# EAGLE design Protoboard MX4-7-6-ESP12 (EAGLE 7.7.0)
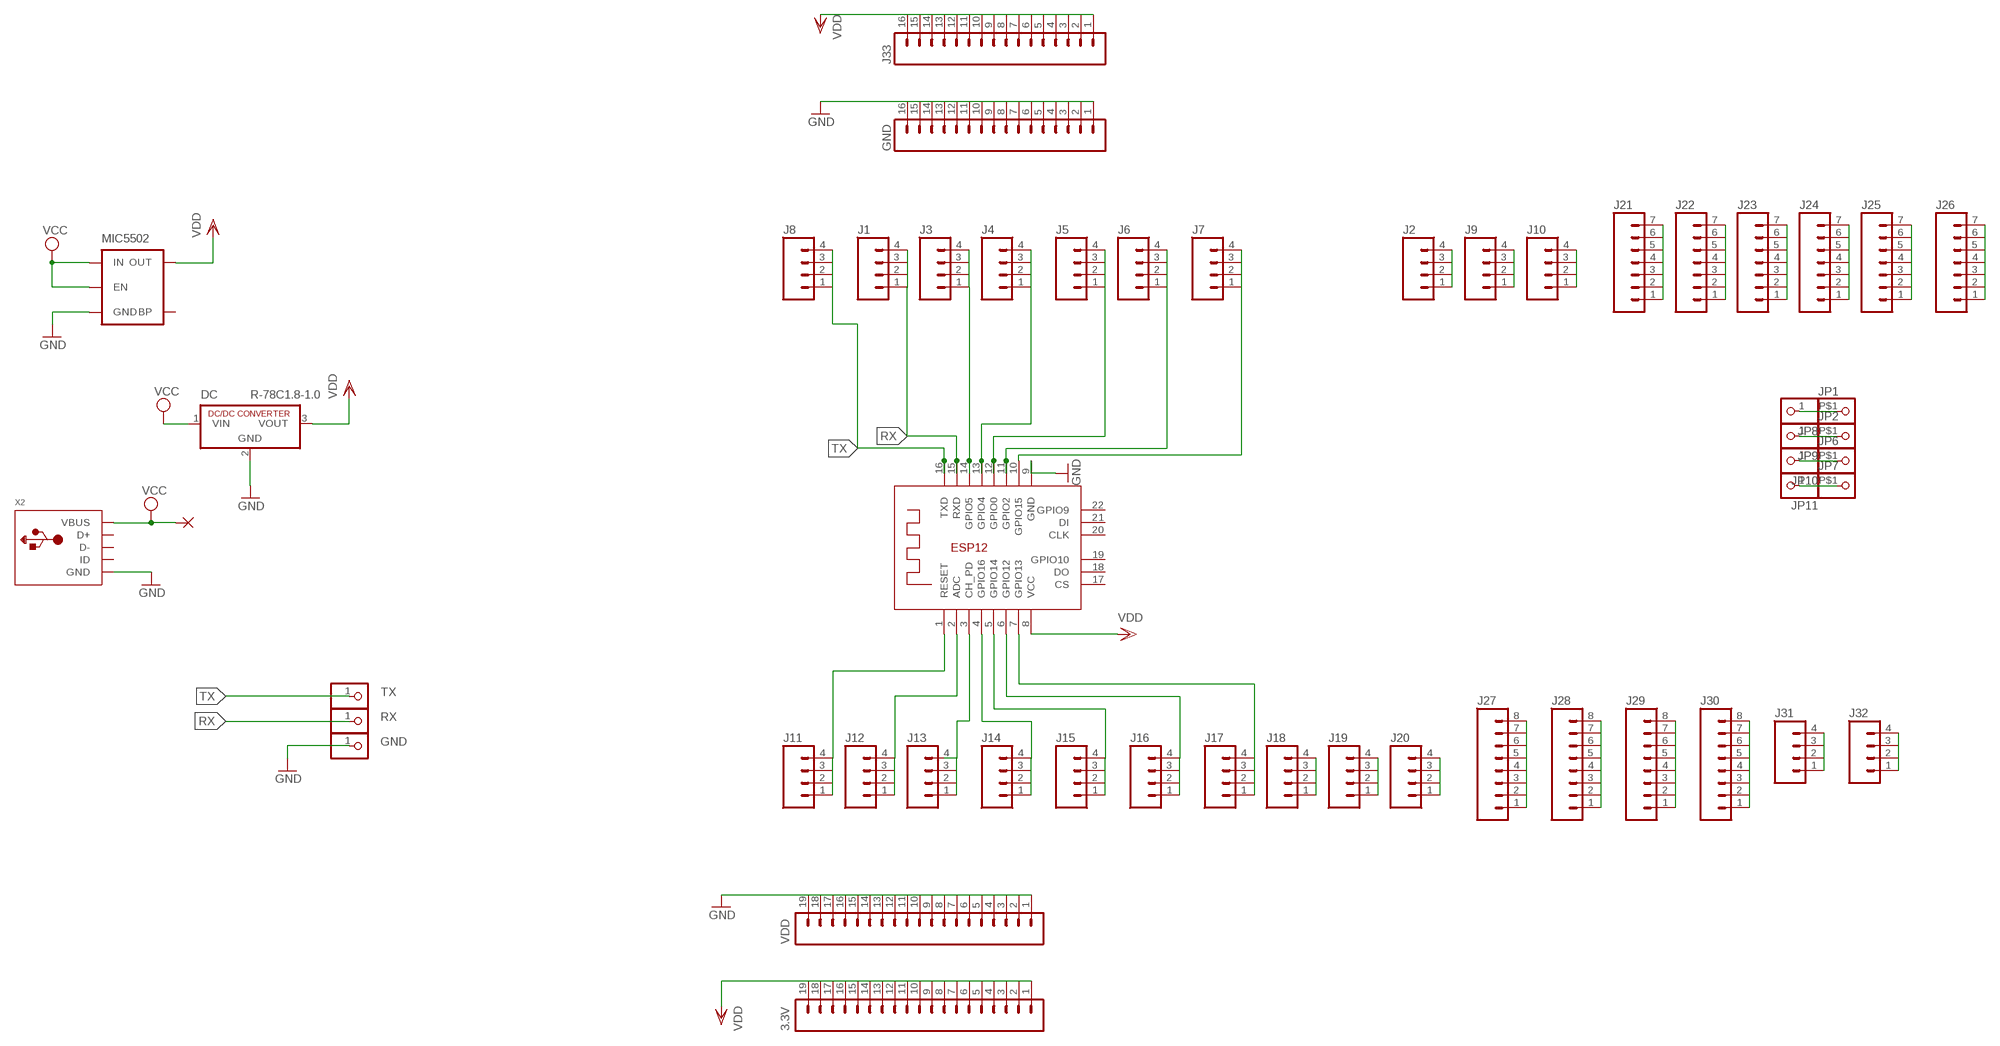
[diagram p0: schematic, sheet 1]

## Parts
3.3V  M191X19_NO_SILK  [1X19_NO_SILK]
5V  1,6/0,8  [1,6/0,8]
DC  R-78C1.8-1.0  [SIP3]
GND  M161X16_NO_SILK  [1X16_NO_SILK]
J1  M04NO_SILK_ALL_ROUND  [1X04_NO_SILK_ALL_ROUND]
J2  M04NO_SILK_ALL_ROUND  [1X04_NO_SILK_ALL_ROUND]
J3  M04NO_SILK_ALL_ROUND  [1X04_NO_SILK_ALL_ROUND]
J4  M04NO_SILK_ALL_ROUND  [1X04_NO_SILK_ALL_ROUND]
J5  M04NO_SILK_ALL_ROUND  [1X04_NO_SILK_ALL_ROUND]
J6  M04NO_SILK_ALL_ROUND  [1X04_NO_SILK_ALL_ROUND]
J7  M04NO_SILK_ALL_ROUND  [1X04_NO_SILK_ALL_ROUND]
J8  M04NO_SILK_ALL_ROUND  [1X04_NO_SILK_ALL_ROUND]
J9  M04NO_SILK_ALL_ROUND  [1X04_NO_SILK_ALL_ROUND]
J10  M04NO_SILK_ALL_ROUND  [1X04_NO_SILK_ALL_ROUND]
J11  M04NO_SILK_ALL_ROUND  [1X04_NO_SILK_ALL_ROUND]
J12  M04NO_SILK_ALL_ROUND  [1X04_NO_SILK_ALL_ROUND]
J13  M04NO_SILK_ALL_ROUND  [1X04_NO_SILK_ALL_ROUND]
J14  M04NO_SILK_ALL_ROUND  [1X04_NO_SILK_ALL_ROUND]
J15  M04NO_SILK_ALL_ROUND  [1X04_NO_SILK_ALL_ROUND]
J16  M04NO_SILK_ALL_ROUND  [1X04_NO_SILK_ALL_ROUND]
J17  M04NO_SILK_ALL_ROUND  [1X04_NO_SILK_ALL_ROUND]
J18  M04NO_SILK_ALL_ROUND  [1X04_NO_SILK_ALL_ROUND]
J19  M04NO_SILK_ALL_ROUND  [1X04_NO_SILK_ALL_ROUND]
J20  M04NO_SILK_ALL_ROUND  [1X04_NO_SILK_ALL_ROUND]
J21  M07NO_SILK  [1X07_NO_SILK]
J22  M07NO_SILK  [1X07_NO_SILK]
J23  M07NO_SILK  [1X07_NO_SILK]
J24  M07NO_SILK  [1X07_NO_SILK]
J25  M07NO_SILK  [1X07_NO_SILK]
J26  M07NO_SILK  [1X07_NO_SILK]
J27  M08NO_SILK_FEMALE_PTH  [1X08_NO_SILK]
J28  M08NO_SILK_FEMALE_PTH  [1X08_NO_SILK]
J29  M08NO_SILK_FEMALE_PTH  [1X08_NO_SILK]
J30  M08NO_SILK_FEMALE_PTH  [1X08_NO_SILK]
J31  M04NO_SILK_ALL_ROUND  [1X04_NO_SILK_ALL_ROUND]
J32  M04NO_SILK_ALL_ROUND  [1X04_NO_SILK_ALL_ROUND]
J33  M161X16_NO_SILK  [1X16_NO_SILK]
JP1  PINHD-1X1-BIGPOGO  [1X1-BIGPOGO]
JP2  PINHD-1X1-BIGPOGO  [1X1-BIGPOGO]
JP3  TX  PINHD-1X1CB  [1X01-CLEANBIG]
JP4  RX  PINHD-1X1CB  [1X01-CLEANBIG]
JP5  GND  PINHD-1X1CB  [1X01-CLEANBIG]
JP6  PINHD-1X1-BIGPOGO  [1X1-BIGPOGO]
JP7  PINHD-1X1-BIGPOGO  [1X1-BIGPOGO]
JP8  PINHD-1X1CB  [1X01-CLEANBIG]
JP9  PINHD-1X1CB  [1X01-CLEANBIG]
JP10  PINHD-1X1CB  [1X01-CLEANBIG]
JP11  PINHD-1X1CB  [1X01-CLEANBIG]
MIC5502  MIC52053.3V  [SOT23-5]
VDD  M191X19_NO_SILK  [1X19_NO_SILK]
X1  ESP-12E  [ESP-12E]
X2  USBMICRO_20329  [4UCONN_20329]

## Nets
GND: DC.2(GND) GND.1 GND.2 GND.3 GND.4 GND.5 GND.6 GND.7 GND.8 GND.9 GND.10 GND.11 GND.12 GND.13 GND.14 GND.15 GND.16 JP5.1 MIC5502.2(GND) VDD.1 VDD.2 VDD.3 VDD.4 VDD.5 VDD.6 VDD.7 VDD.8 VDD.9 VDD.10 VDD.11 VDD.12 VDD.13 VDD.14 VDD.15 VDD.16 VDD.17 VDD.18 VDD.19 X1.9(GND) X2.BASE@1(GND) X2.BASE@2(GND) X2.GND X2.SPRT@1(GND) X2.SPRT@2(GND) X2.SPRT@3(GND) X2.SPRT@4(GND)
N$1: J21.1 J21.2 J21.3 J21.4 J21.5 J21.6 J21.7
N$8: J2.1 J2.2 J2.3 J2.4
N$9: J3.1 J3.2 J3.3 J3.4 X1.14(GPIO5)
N$10: J4.1 J4.2 J4.3 J4.4 X1.13(GPIO4)
N$11: J5.1 J5.2 J5.3 J5.4 X1.12(GPIO0)
N$12: J6.1 J6.2 J6.3 J6.4 X1.11(GPIO2)
N$13: J7.1 J7.2 J7.3 J7.4 X1.10(GPIO15)
N$14: J9.1 J9.2 J9.3 J9.4
N$15: J10.1 J10.2 J10.3 J10.4
N$16: J18.1 J18.2 J18.3 J18.4
N$17: J22.1 J22.2 J22.3 J22.4 J22.5 J22.6 J22.7
N$18: J23.1 J23.2 J23.3 J23.4 J23.5 J23.6 J23.7
N$19: J24.1 J24.2 J24.3 J24.4 J24.5 J24.6 J24.7
N$20: J25.1 J25.2 J25.3 J25.4 J25.5 J25.6 J25.7
N$21: J26.1 J26.2 J26.3 J26.4 J26.5 J26.6 J26.7
N$22: J27.1 J27.2 J27.3 J27.4 J27.5 J27.6 J27.7 J27.8
N$23: J19.1 J19.2 J19.3 J19.4
N$24: J20.1 J20.2 J20.3 J20.4
N$25: J28.1 J28.2 J28.3 J28.4 J28.5 J28.6 J28.7 J28.8
N$26: J14.1 J14.2 J14.3 J14.4 X1.4(GPIO16)
N$27: J29.1 J29.2 J29.3 J29.4 J29.5 J29.6 J29.7 J29.8
N$28: J30.1 J30.2 J30.3 J30.4 J30.5 J30.6 J30.7 J30.8
N$29: J31.1 J31.2 J31.3 J31.4
N$30: J32.1 J32.2 J32.3 J32.4
N$31: JP1.P$1 JP8.1
N$32: JP2.P$1 JP9.1
N$33: JP6.P$1 JP10.1
N$34: J17.1 J17.2 J17.3 J17.4 X1.7(GPIO13)
N$35: JP7.P$1 JP11.1
N$50: J11.1 J11.2 J11.3 J11.4 X1.1(RESET)
N$51: J12.1 J12.2 J12.3 J12.4 X1.2(ADC)
N$52: J13.1 J13.2 J13.3 J13.4 X1.3(CH_PD)
N$55: J15.1 J15.2 J15.3 J15.4 X1.5(GPIO14)
N$56: J16.1 J16.2 J16.3 J16.4 X1.6(GPIO12)
RX: J1.1 J1.2 J1.3 J1.4 JP4.1 X1.15(RXD)
TX: J8.1 J8.2 J8.3 J8.4 JP3.1 X1.16(TXD)
VCC: 5V.1(P) DC.1(VIN) MIC5502.1(IN) MIC5502.3(EN) X2.VBUS
VDD: 3.3V.1 3.3V.2 3.3V.3 3.3V.4 3.3V.5 3.3V.6 3.3V.7 3.3V.8 3.3V.9 3.3V.10 3.3V.11 3.3V.12 3.3V.13 3.3V.14 3.3V.15 3.3V.16 3.3V.17 3.3V.18 3.3V.19 DC.3(VOUT) J33.1 J33.2 J33.3 J33.4 J33.5 J33.6 J33.7 J33.8 J33.9 J33.10 J33.11 J33.12 J33.13 J33.14 J33.15 J33.16 MIC5502.5(OUT) X1.8(VCC)
Unconnected: MIC5502.4(BP) X1.17(CS) X1.18(DO) X1.19(GPIO10) X1.20(CLK) X1.21(DI) X1.22(GPIO9) X2.D+ X2.D- X2.ID

## Library data of the parts
3.3V VDD = SparkFun-Connectors:M19: 1x19 .1" header
5V = wirepad:1,6/0,8: THROUGH-HOLE PAD
DC = dc-dc-converter:R-78C*-1.0: INNOLINE DC/DC-Converter 1.0 AMP SIP3 Single Output Source: Data sheet <http://www.mikrocontroller.net/attachment/150645/157764-da-01-en-DC_DC_WANDLER_R_78C5_0_1_0.pdf>
GND J33 = SparkFun-Connectors:M16: 1x16 .1" header
J1-J20 J31 J32 = SparkFun-Connectors:M04: Header 4 Standard 4-pin 0.1" header. Use with straight break away headers (SKU : PRT-00116), right angle break away headers (PRT-00553), swiss pins (PRT-00743), machine pins (PRT-00117), and female headers (PRT-00115). Molex polarized connector foot print use with SKU : PRT-08231 with associated crimp pins and housings. 1MM SMD Version SKU: PRT-10208; PROD_ID: CONN-09696
J21-J26 = SparkFun-Connectors:M07: Header 7 Standard 7-pin 0.1" header. Use with straight break away headers (SKU : PRT-00116), right angle break away headers (PRT-00553), swiss pins (PRT-00743), machine pins (PRT-00117), and female headers (PRT-00115). NOTES ON THE VARIANTS LOCK and LOCK_LONGPADS... This footprint was designed to help hold the alignment of a through-hole component (i.e. 7-pin header) while soldering it into place. You may notice that each hole has been shifted either up or down by 0.005 of an inch from it's more standard position (which is usually a perfectly straight line). This slight alteration caused the pins (the squares in the middle) to touch the edges of the holes. Because they are alternating, it causes a "brace" to hold the header in place. 0.005 has proven to be the perfect amount of "off-center" position when using our standard breakaway headers. Although looks a little odd when you look at the bare footprint, once you have a header in there, the alteration is very hard to notice. Also, if you push a header all the way into place, it is covered up entirely on the bottom side. This idea of altering the position of holes to aid alignment will be further integrated into the Sparkfun Library for other footprints. It can help hold any component with 3 or more connection pins.
J27-J30 = SparkFun-Connectors:M08: Header 8 Standard 8-pin 0.1" header. Use with straight break away headers (SKU : PRT-00116), right angle break away headers (PRT-00553), swiss pins (PRT-00743), machine pins (PRT-00117), and female headers (PRT-00115).; PROD_ID: CONN-08438
JP1-JP11 = adafruit:PINHD-1X1: Pin header 1x1 for 0.1" spacing With round pins
MIC5502 = SparkFun-PowerIC:MIC5205: MIC5205 150mA vreg 3.3V - VREG-00822 5V - VREG-00823; PROD_ID: VREG-00822
X1 = microbuilder:ESP-12E
X2 = microbuilder:USB: USB Connectors USBMINIB - Surface Mount Female Mini-B USB Connector 4UConnector: 06564

## Net classes
0 default: width 0.508 mm, drill 0.508 mm, clearance 0.127 mm

## Board
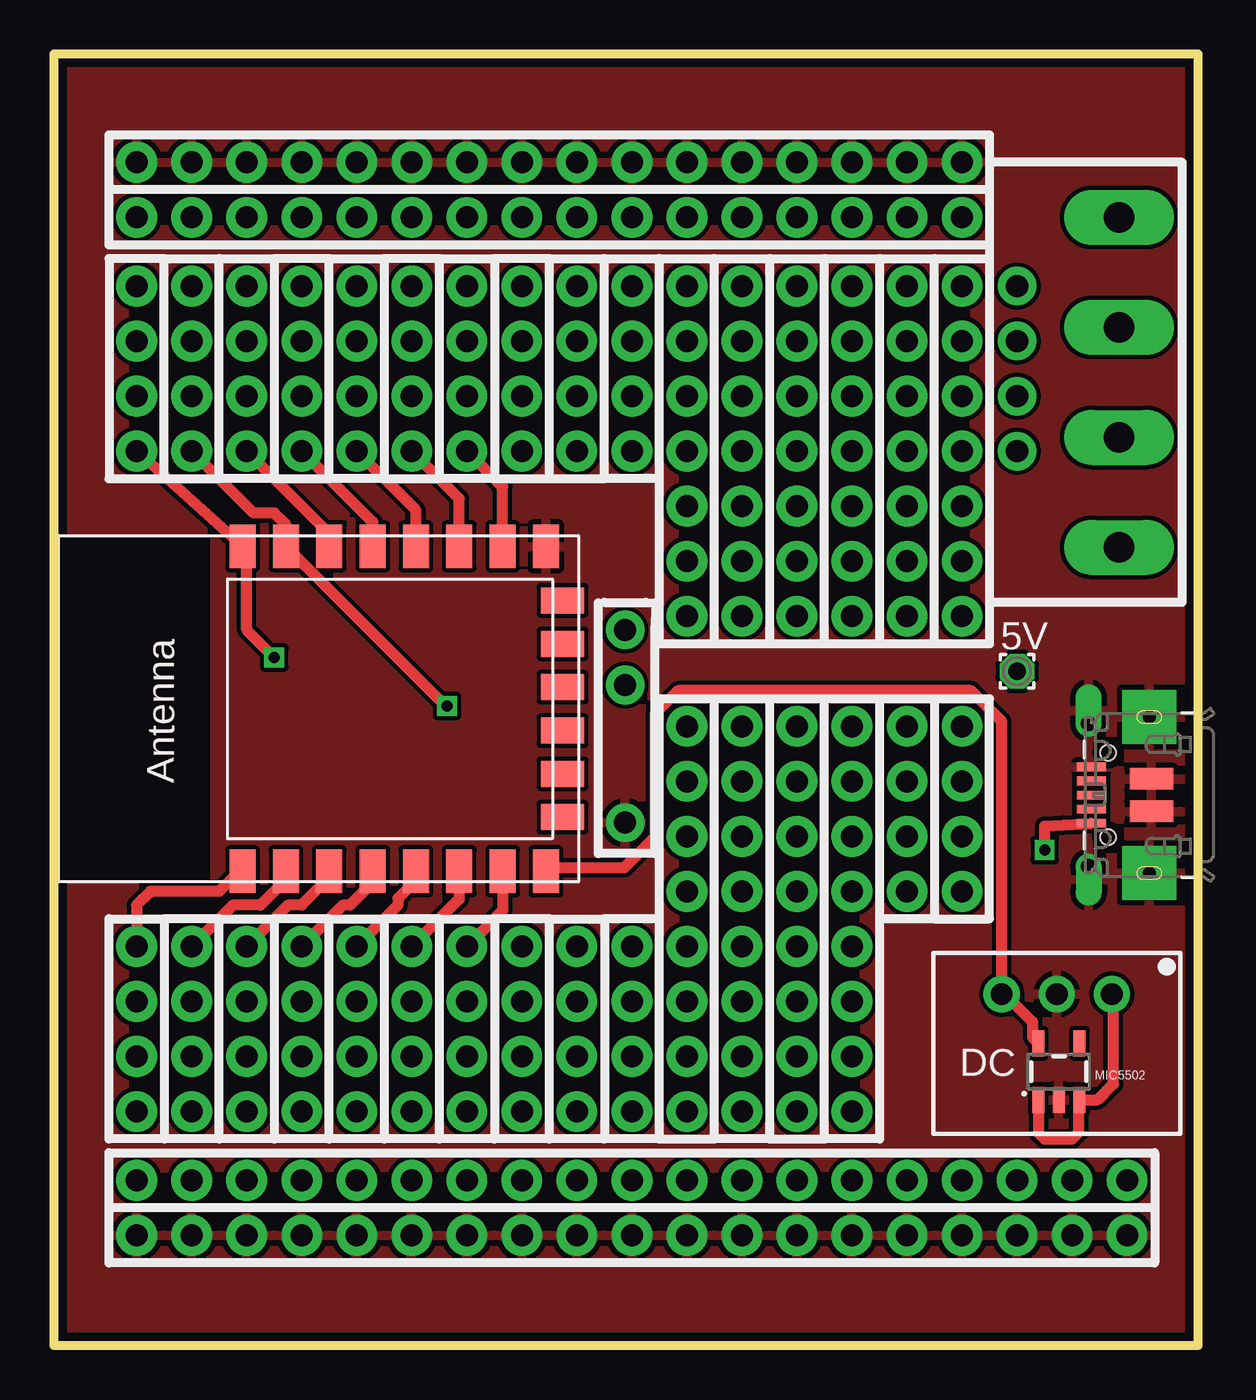
[diagram p1: board, top side]
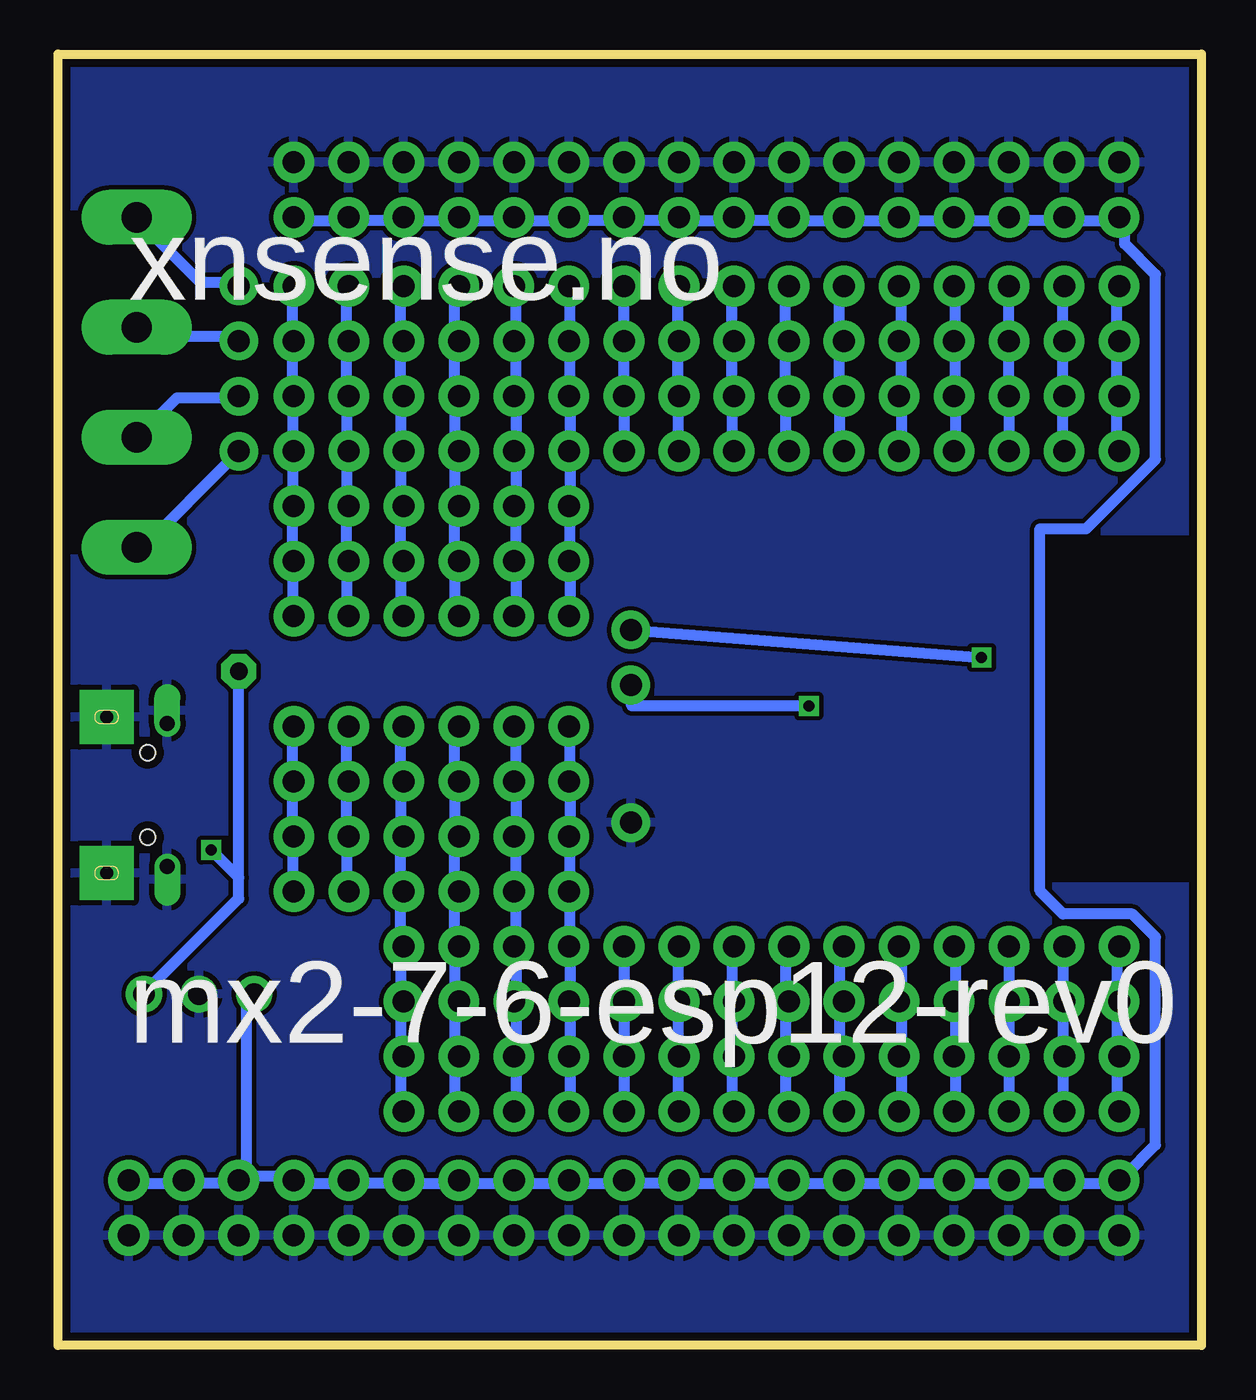
[diagram p2: board, bottom side, seen from below]

Size 52.8 x 59.6 mm. Coordinates in mm from the lower left corner, seen from the top.
Outline: 0,0 0,59.6 52.8,59.6 52.8,0 0,0
Copper layers (1*16): Top 0.035mm / dielectric 1.5mm / Bottom 0.035mm
Design rules "default *": minimum track width 10mil, minimum drill 20mil, track to track 8mil, track to pad 8mil, pad to pad 8mil, via to via 8mil, smd to smd 8mil, copper to edge 15mil, drill to drill 8mil, minimum pad ring 10mil, minimum via ring 8mil, stop-mask expansion 4mil, vias tented up to drill 0mil, thermal gap 10mil

### Footprints (pad centres in the part's own frame; a part is rotated, then mirrored left to right if it is on the bottom)
1X19_NO_SILK = drill 1.016 pad 1.88: 1 0,0; 2 2.54,0; 3 5.08,0; 4 7.62,0; 5 10.16,0; 6 12.7,0; 7 15.24,0; 8 17.78,0; 9 20.32,0; 10 22.86,0; 11 25.4,0; 12 27.94,0; 13 30.48,0; 14 33.02,0; 15 35.56,0; 16 38.1,0; 17 40.64,0; 18 43.18,0; 19 45.72,0
1,6/0,8 = drill 0.813 pad 1.6 octagon: 1 0,0
SIP3 = drill 1 pad 1.676: 1 -2.54,0; 2 0,0; 3 2.54,0
1X16_NO_SILK = drill 1.016 pad 1.88: 1 0,0; 2 2.54,0; 3 5.08,0; 4 7.62,0; 5 10.16,0; 6 12.7,0; 7 15.24,0; 8 17.78,0; 9 20.32,0; 10 22.86,0; 11 25.4,0; 12 27.94,0; 13 30.48,0; 14 33.02,0; 15 35.56,0; 16 38.1,0
1X04_NO_SILK_ALL_ROUND = drill 1.016 pad 1.88: 1 0,0; 2 2.54,0; 3 5.08,0; 4 7.62,0
1X07_NO_SILK = drill 1.016 pad 1.88: 1 0,0; 2 2.54,0; 3 5.08,0; 4 7.62,0; 5 10.16,0; 6 12.7,0; 7 15.24,0
1X08_NO_SILK = drill 1.016 pad 1.88: 1 0,0; 2 2.54,0; 3 5.08,0; 4 7.62,0; 5 10.16,0; 6 12.7,0; 7 15.24,0; 8 17.78,0
1X1-BIGPOGO = drill 1.4 pad 2.54 long: P$1 0,0
1X01-CLEANBIG = drill 1.016 pad 1.778: 1 0,0
SOT23-5 = smd 0.55 x 1.2: 1 -0.95,-1.3; 2 0,-1.3; 3 0.95,-1.3; 4 0.95,1.3; 5 -0.95,1.3
ESP-12E = smd 2 x 1.2: 1 -7.5,5.77; 2 -7.5,3.77; 3 -7.5,1.77; 4 -7.5,-0.23; 5 -7.5,-2.23; 6 -7.5,-4.23; 7 -7.5,-6.23; 8 -7.5,-8.23; 9 7.5,-8.23; 10 7.5,-6.23; 11 7.5,-4.23; 12 7.5,-2.23; 13 7.5,-0.23; 14 7.5,1.77; 15 7.5,3.77; 16 7.5,5.77 | smd 1.2 x 2: 17 -5,-9; 18 -3,-9; 19 -1,-9; 20 1,-9; 21 3,-9; 22 5,-9
4UCONN_20329 = smd 1 x 2: BASE@1 -0.75,-2; BASE@2 0.75,-2 | smd 0.4 x 1.35: D+ 0,0.775; D- -0.65,0.775; GND 1.3,0.775; ID 0.65,0.775; VBUS -1.3,0.775 | drill 0.7 offset: SPRT@1 -3.3,0.9; SPRT@2 3.3,0.9 | drill 0.6 pad 2.5 square: SPRT@3 -3.6,-1.9; SPRT@4 3.6,-1.9 | hole 0.7: -1.95,0; 1.95,0

### Placement (x,y rotation side)
3.3V  3.81,7.62 0 top
5V  44.45,31.11 0 top
DC  46.28,16.21 180 top
GND  3.81,54.61 0 top
J1  6.35,41.27 90 top
J2  21.59,41.27 90 top
J3  8.89,41.27 90 top
J4  11.43,41.27 90 top
J5  13.97,41.27 90 top
J6  16.51,41.27 90 top
J7  19.05,41.27 90 top
J8  3.81,41.27 90 top
J9  24.13,41.27 90 top
J10  26.67,41.27 90 top
J11  3.81,10.79 90 top
J12  6.35,10.79 90 top
J13  8.89,10.79 90 top
J14  11.43,10.79 90 top
J15  13.97,10.79 90 top
J16  16.51,10.79 90 top
J17  19.05,10.79 90 top
J18  21.59,10.79 90 top
J19  24.13,10.79 90 top
J20  26.67,10.79 90 top
J21  29.21,33.66 90 top
J22  31.75,33.66 90 top
J23  34.29,33.66 90 top
J24  36.83,33.66 90 top
J25  39.37,33.66 90 top
J26  41.91,33.66 90 top
J27  29.21,10.79 90 top
J28  31.75,10.79 90 top
J29  34.29,10.79 90 top
J30  36.83,10.79 90 top
J31  39.37,20.95 90 top
J32  41.91,20.95 90 top
J33  3.81,52.07 0 top
JP1  49.16,52.07 0 top
JP2  49.16,46.99 0 top
JP3  26.35,33.02 0 top
JP4  26.35,30.48 0 top
JP5  26.35,24.13 0 top
JP6  49.16,41.91 0 top
JP7  49.16,36.83 0 top
JP8  44.45,48.9 0 top
JP9  44.45,46.35 0 top
JP10  44.45,43.81 0 top
JP11  44.45,41.27 0 top
MIC5502  46.38,12.64 0 top
VDD  3.81,5.08 0 top
X1  14.47,29.38 90 top
X2  48.65,25.4 90 top

### Tracks (layer width: path | path; a pad name or v marks a point on that pad's centre or on a via)
GND
  pour Top: 0,59.6 0,0 52.8,0 52.8,59.6
  pour Bottom: 0,59.6 0,0 52.8,0 52.8,59.6
N$1
  Bottom 0.508: J21.1 29.16,33.78 29.16,35.92 J21.2 29.16,36.27 29.16,38.41 J21.3 29.16,38.76 29.16,41.25 J21.4 29.16,41.6 29.16,43.74 J21.5 29.16,44.09 29.16,46.23 J21.6 29.16,46.58 29.16,48.72 J21.7
N$8
  Bottom 0.508: J2.1 21.69,41.6 21.69,43.74 J2.2 21.69,44.09 21.69,46.23 J2.3 21.69,46.58 21.69,48.72 J2.4
N$9
  Top 0.508: X1.14 12.7,37.47 J3.1
  Bottom 0.508: J3.1 J3.2 J3.3 J3.4
N$10
  Top 0.508: X1.13 14.7,38.01 J4.1
  Bottom 0.508: J4.1 11.38,41.6 11.38,43.74 J4.2 11.38,44.09 11.38,46.23 J4.3 11.38,46.58 11.38,48.72 J4.4
N$11
  Top 0.508: X1.12 16.7,38.55 J5.1
  Bottom 0.508: J5.1 13.87,41.6 13.87,43.74 J5.2 13.87,44.09 13.87,46.23 J5.3 13.87,46.58 13.87,48.72 J5.4
N$12
  Top 0.508: X1.11 18.7,39.09 J6.1
  Bottom 0.508: J6.1 16.71,41.6 16.71,43.74 J6.2 16.71,44.09 16.71,46.23 J6.3 16.71,46.58 16.71,48.72 J6.4
N$13
  Top 0.508: X1.10 20.7,39.62 J7.1
  Bottom 0.508: J7.1 19.2,41.6 19.2,43.74 J7.2 19.2,44.09 19.2,46.23 J7.3 19.2,46.58 19.2,48.72 J7.4
N$14
  Bottom 0.508: J9.1 24.18,41.6 24.18,43.74 J9.2 24.18,44.09 24.18,46.23 J9.3 24.18,46.58 24.18,48.72 J9.4
N$15
  Bottom 0.508: J10.1 J10.2 J10.3 J10.4
N$16
  Bottom 0.508: J18.1 21.69,11.02 21.69,13.16 J18.2 21.69,13.51 21.69,15.65 J18.3 21.69,16 21.69,18.14 J18.4
N$17
  Bottom 0.508: J22.1 31.65,33.78 31.65,35.92 J22.2 31.65,36.27 31.65,38.41 J22.3 31.65,38.76 31.65,41.25 J22.4 31.65,41.6 31.65,43.74 J22.5 31.65,44.09 31.65,46.23 J22.6 31.65,46.58 31.65,48.72 J22.7
N$18
  Bottom 0.508: J23.1 34.49,33.78 34.49,35.92 J23.2 34.49,36.27 34.49,38.41 J23.3 34.49,38.76 34.49,41.25 J23.4 34.49,41.6 34.49,43.74 J23.5 34.49,44.09 34.49,46.23 J23.6 34.49,46.58 34.49,48.72 J23.7
N$19
  Bottom 0.508: J24.1 36.98,33.78 36.98,35.92 J24.2 36.98,36.27 36.98,38.41 J24.3 36.98,38.76 36.98,41.25 J24.4 36.98,41.6 36.98,43.74 J24.5 36.98,44.09 36.98,46.23 J24.6 36.98,46.58 36.98,48.72 J24.7
N$20
  Bottom 0.508: J25.1 39.47,33.78 39.47,35.92 J25.2 39.47,36.27 39.47,38.41 J25.3 39.47,38.76 39.47,41.25 J25.4 39.47,41.6 39.47,43.74 J25.5 39.47,44.09 39.47,46.23 J25.6 39.47,46.58 39.47,48.72 J25.7
N$21
  Bottom 0.508: J26.1 41.96,33.78 41.96,35.92 J26.2 41.96,36.27 41.96,38.41 J26.3 41.96,38.76 41.96,41.25 J26.4 41.96,41.6 41.96,43.74 J26.5 41.96,44.09 41.96,46.23 J26.6 41.96,46.58 41.96,48.72 J26.7
N$22
  Bottom 0.508: J27.8 29.16,28.45 29.16,26.31 J27.7 29.16,25.96 29.16,23.82 J27.6 29.16,23.47 29.16,20.98 J27.5 29.16,20.62 29.16,18.49 J27.4 29.16,18.14 29.16,16 J27.3 29.16,15.65 29.16,13.51 J27.2 29.16,13.16 29.16,11.02 J27.1
N$23
  Bottom 0.508: J19.1 24.18,11.02 24.18,13.16 J19.2 24.18,13.51 24.18,15.65 J19.3 24.18,16 24.18,18.14 J19.4
N$24
  Bottom 0.508: J20.1 J20.2 J20.3 J20.4
N$25
  Bottom 0.508: J28.8 31.65,28.45 31.65,26.31 J28.7 31.65,25.96 31.65,23.82 J28.6 31.65,23.47 31.65,20.98 J28.5 31.65,20.62 31.65,18.49 J28.4 31.65,18.14 31.65,16 J28.3 31.65,15.65 31.65,13.51 J28.2 31.65,13.16 31.65,11.02 J28.1
N$26
  Top 0.508: X1.4 14.7,21.37 13.65,20.32 13.34,20.32 J14.4
  Bottom 0.508: J14.1 11.38,11.02 11.38,13.16 J14.2 11.38,13.51 11.38,15.65 J14.3 11.38,16 11.38,18.14 J14.4
N$27
  Bottom 0.508: J29.8 34.49,28.45 34.49,26.31 J29.7 34.49,25.96 34.49,23.82 J29.6 34.49,23.47 34.49,20.98 J29.5 34.49,20.62 34.49,18.49 J29.4 34.49,18.14 34.49,16 J29.3 34.49,15.65 34.49,13.51 J29.2 34.49,13.16 34.49,11.02 J29.1
N$28
  Bottom 0.508: J30.8 36.98,28.45 36.98,26.31 J30.7 36.98,25.96 36.98,23.82 J30.6 36.98,23.47 36.98,20.98 J30.5 36.98,20.62 36.98,18.49 J30.4 36.98,18.14 36.98,16 J30.3 36.98,15.65 36.98,13.51 J30.2 36.98,13.16 36.98,11.02 J30.1
N$29
  Bottom 0.508: J31.1 39.47,20.98 39.47,23.47 J31.2 39.47,23.82 39.47,25.96 J31.3 39.47,26.31 39.47,28.45 J31.4
N$30
  Bottom 0.508: J32.1 41.96,20.98 41.96,23.47 J32.2 41.96,23.82 41.96,25.96 J32.3 41.96,26.31 41.96,28.45 J32.4
N$31
  Bottom 0.508: JP8.1 44.45,49.07 46.23,49.07 49.07,51.92 JP1.P$1
N$32
  Bottom 0.508: JP9.1 44.45,46.58 48.72,46.58 49.07,46.94 JP2.P$1
N$33
  Bottom 0.508: JP10.1 44.45,43.74 47.3,43.74 49.07,41.96 JP6.P$1
N$34
  Top 0.508: X1.7 20.7,20.07 J17.4
  Bottom 0.508: J17.1 19.2,11.02 19.2,13.16 J17.2 19.2,13.51 19.2,15.65 J17.3 19.2,16 19.2,18.14 J17.4
N$35
  Bottom 0.508: JP11.1 44.45,41.25 49.07,36.63 JP7.P$1
N$50
  Top 0.508: X1.1 8.54,21.88 7.62,20.95 4.45,20.95 3.81,20.32 J11.4
  Bottom 0.508: J11.1 3.91,11.02 3.91,13.16 J11.2 3.91,13.51 3.91,15.65 J11.3 3.91,16 3.91,18.14 J11.4
N$51
  Top 0.508: X1.2 10.7,21.5 9.53,20.32 8.26,20.32 J12.4
  Bottom 0.508: J12.1 6.4,11.02 6.4,13.16 J12.2 6.4,13.51 6.4,15.65 J12.3 6.4,16 6.4,18.14 J12.4
N$52
  Top 0.508: X1.3 12.7,21.59 11.43,20.32 10.79,20.32 J13.4
  Bottom 0.508: J13.1 J13.2 J13.3 J13.4
N$55
  Top 0.508: X1.5 16.7,21.46 15.88,20.64 15.88,20.32 J15.4
  Bottom 0.508: J15.1 13.87,11.02 13.87,13.16 J15.2 13.87,13.51 13.87,15.65 J15.3 13.87,16 13.87,18.14 J15.4
N$56
  Top 0.508: X1.6 18.7,20.61 J16.4
  Bottom 0.508: J16.1 16.71,11.02 16.71,13.16 J16.2 16.71,13.51 16.71,15.65 J16.3 16.71,16 16.71,18.14 J16.4
RX  (via drill 0.51)
  Top 0.508: J1.1 9.21,38.42 10.16,38.42 10.7,37.88 X1.15 18.07,29.52 v18.14,29.52
  Bottom 0.508: v18.14,29.52 26.31,29.52 JP4.1 | 6.4,41.25 J1.1 6.4,41.6 6.4,43.74 J1.2 6.4,44.09 6.4,46.23 J1.3 6.4,46.58 6.4,48.72 J1.4
TX  (via drill 0.51)
  Top 0.508: J8.1 X1.16 8.89,36.69 8.89,33.02 v10.16,31.75
  Bottom 0.508: J8.1 3.91,41.6 3.91,43.74 J8.2 3.91,44.09 3.91,46.23 J8.3 3.91,46.58 3.91,48.72 J8.4 | JP3.1 v10.16,31.75
VCC  (via drill 0.51)
  Top 0.508: MIC5502.1 45.43,9.81 45.72,9.53 46.99,9.53 47.31,9.84 47.31,11.32 MIC5502.3 48.17,11.34 48.9,12.06 48.9,16.14 DC.1 | v45.72,22.86 45.72,23.97 X2.VBUS
  Bottom 0.508: 44.45,21.59 5V.1 | DC.1 48.72,16.36 44.45,20.62 44.45,21.59 | 44.45,21.59 v45.72,22.86
VDD
  Top 0.508: MIC5502.5 45.16,14.22 45.16,14.94 44.09,16 DC.3 43.74,16.36 43.74,28.8 42.32,30.23 28.8,30.23 27.74,29.16 27.74,23.47 26.31,22.05 22.76,22.05 X1.8
  Bottom 0.508: J33.16 41.6,51.92 39.47,51.92 J33.15 39.12,51.92 36.98,51.92 J33.14 36.63,51.92 34.49,51.92 J33.13 34.14,51.92 32,51.92 J33.12 31.65,51.92 29.52,51.92 J33.11 29.16,51.92 26.67,51.92 | 26.67,51.92 24.18,51.92 J33.9 23.82,51.92 21.69,51.92 J33.8 21.34,51.92 19.2,51.92 J33.7 18.85,51.92 16.71,51.92 J33.6 16.36,51.92 14.22,51.92 J33.5 13.87,51.92 11.73,51.92 J33.4 11.38,51.92 8.89,51.92 | 8.89,51.92 6.4,51.92 J33.2 6.04,51.92 3.91,51.92 J33.1 3.56,51.92 3.56,50.85 2.13,49.43 2.13,40.89 5.33,37.69 7.47,37.69 7.47,20.98 6.4,19.91 3.2,19.91 2.13,18.85 2.13,9.25 3.56,7.82 3.3V.1 3.91,7.47 6.04,7.47 3.3V.2 6.4,7.47 8.89,7.47 | 8.89,51.92 J33.3 | 26.67,51.92 J33.10 | 26.67,7.47 24.18,7.47 3.3V.9 23.82,7.47 21.69,7.47 3.3V.8 21.34,7.47 19.2,7.47 3.3V.7 18.85,7.47 16.71,7.47 3.3V.6 16.36,7.47 14.22,7.47 3.3V.5 13.87,7.47 11.73,7.47 3.3V.4 11.38,7.47 8.89,7.47 | 8.89,7.47 3.3V.3 | 3.3V.19 49.43,7.47 47.3,7.47 3.3V.18 46.94,7.47 44.45,7.47 3.3V.17 | DC.3 44.09,16 44.09,8.18 44.45,7.82 3.3V.17 | 3.3V.17 44.09,7.82 41.96,7.82 3.3V.16 41.6,7.47 39.47,7.47 3.3V.15 39.12,7.47 36.98,7.47 3.3V.14 36.63,7.47 34.49,7.47 3.3V.13 34.14,7.47 32,7.47 3.3V.12 31.65,7.47 29.52,7.47 3.3V.11 29.16,7.47 26.67,7.47 | 26.67,7.47 3.3V.10

### Text on the board
bNames: xnsense.no | mx2-7-6-esp12-rev0